# EAGLE design H0FR6 (EAGLE 9.6.1)

## Sheet 1 of 2
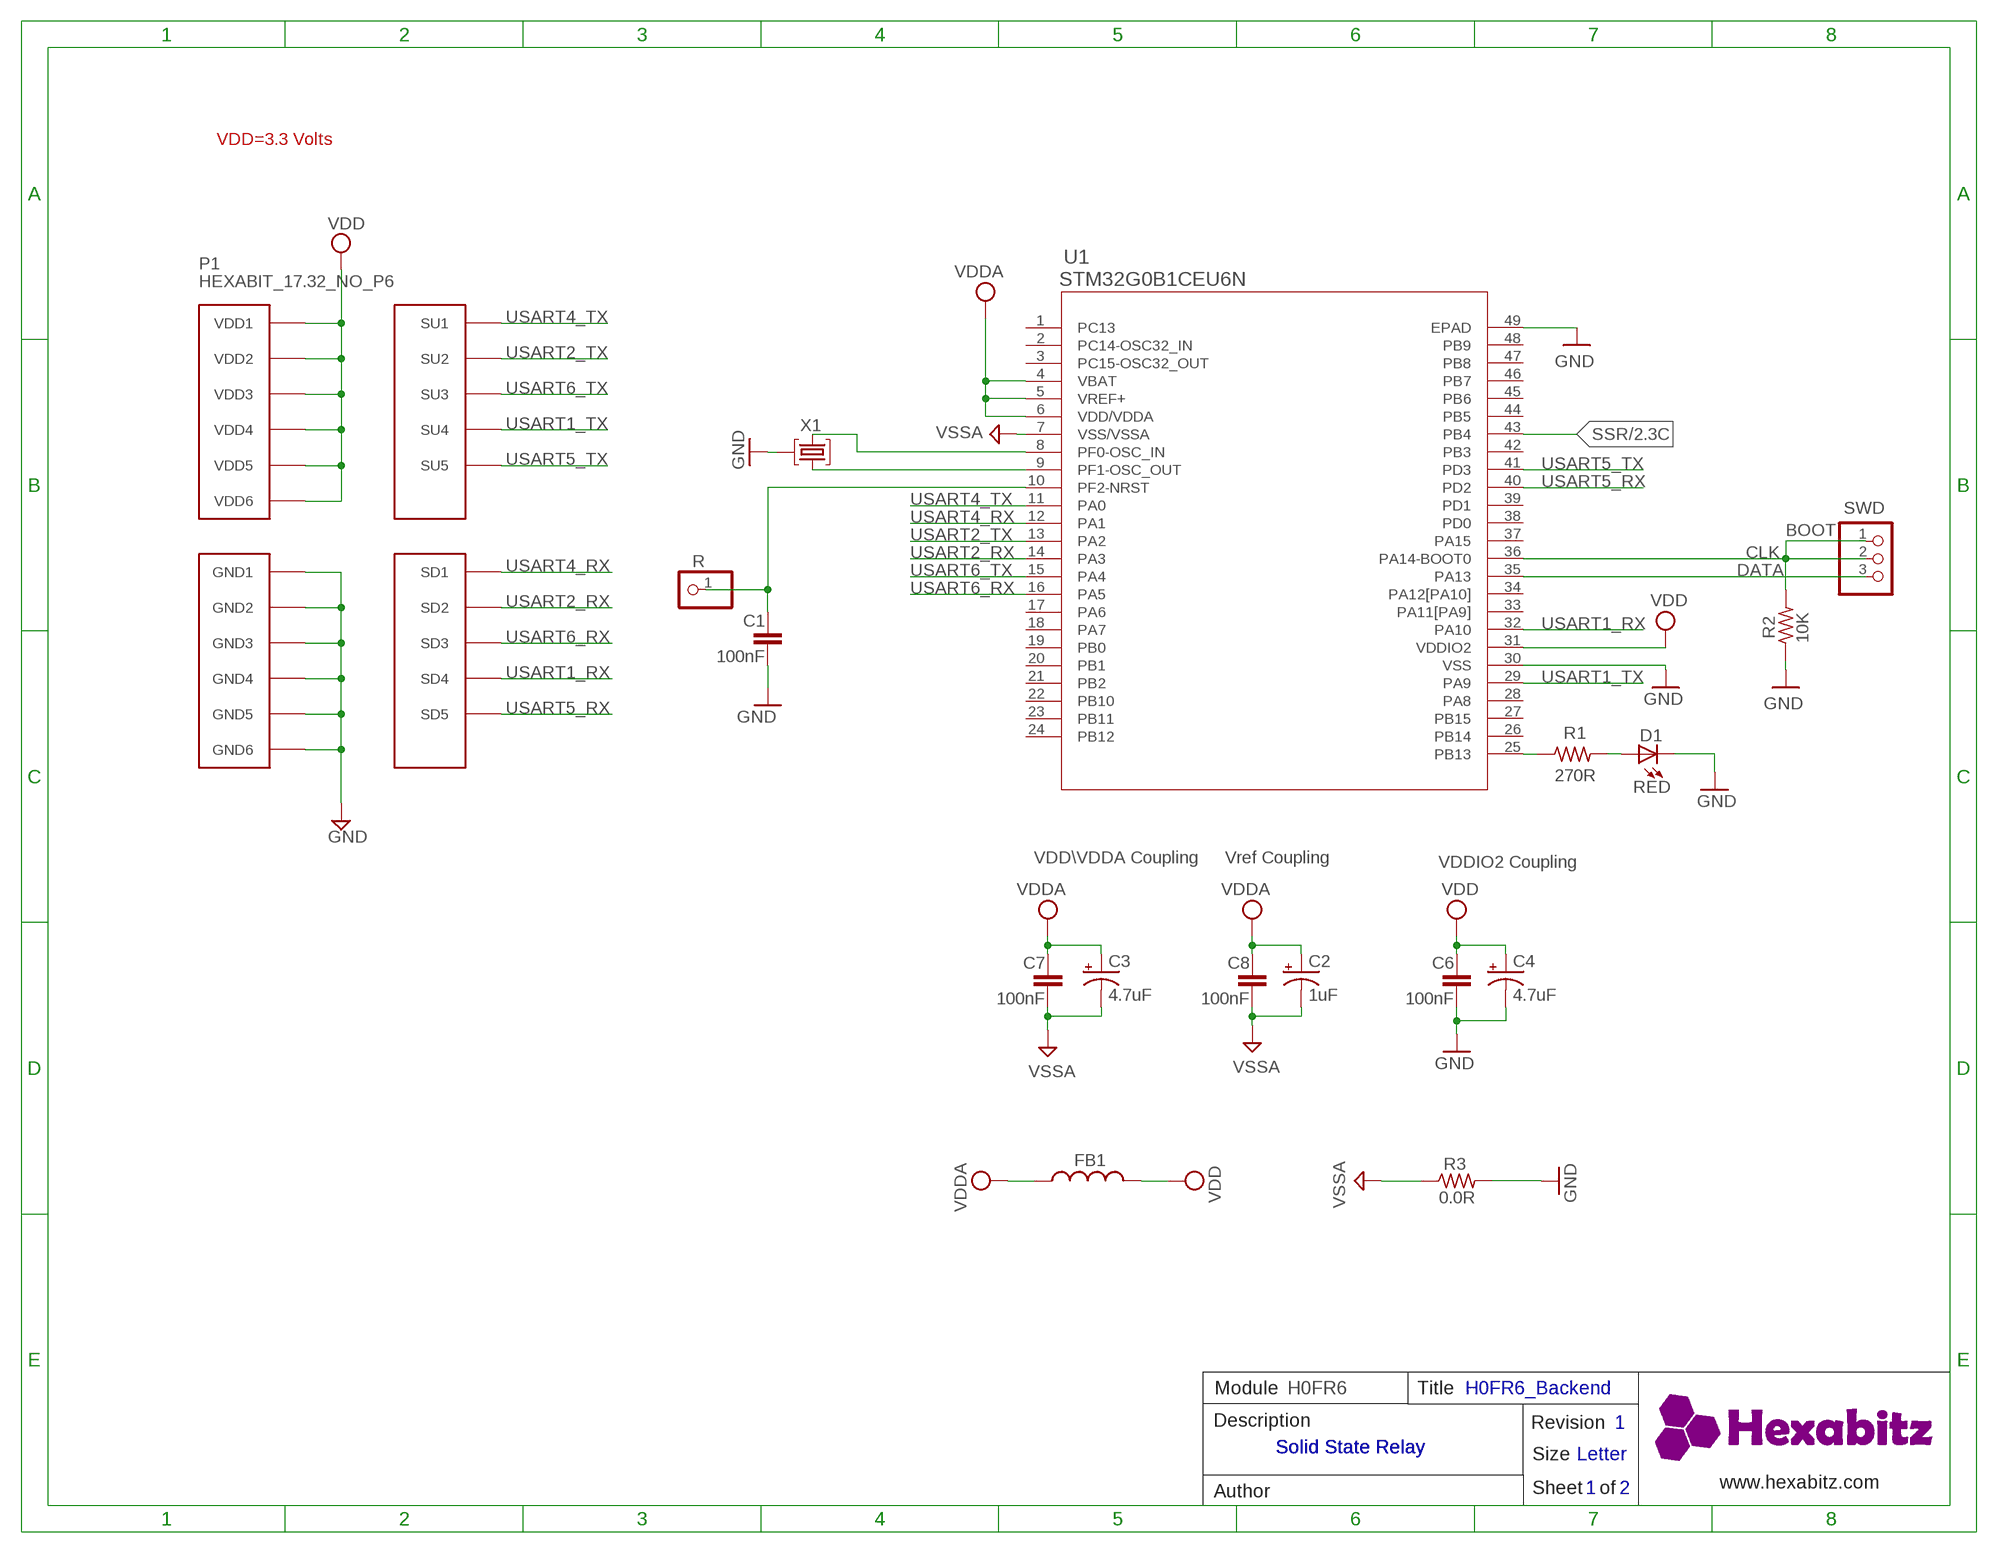
[diagram p0: schematic, sheet 1]

### Parts
C1  100nF  C-0603  [C-0603]
C2  1uF  C-0805-POL  [C-0805-POL]
C3  4.7uF  C-0805-POL  [C-0805-POL]
C4  4.7uF  C-0805-POL  [C-0805-POL]
C6  100nF  C-0603  [C-0603]
C7  100nF  C-0603  [C-0603]
C8  100nF  C-0603  [C-0603]
D1  RED  VLMS1300-GS08  [VLMS1300-GS08]
FB1  FB-0603  [FB-0603]
P1  HEXABIT_17.32_NO_P6  [HEXABIT_17.32_NO_P6]
R  R  PINHD-1X1  [1X01]
R1  270R  R-0603  [R-0603]
R2  10K  R-0603  [R-0603]
R3  0.0R  R-0603  [R-0603]
SWD  PINHD-1X3  [1X03]
U1  STM32G0B1CEU6N  [HEXABITZ_ICS_QFN_B1CEU6_STM-L]
X1  XTALL_CSTCE8M00G52  [XTALL_CSTCE8M00G52]

### Nets
CLK: R2.2 SWD.1 SWD.2 U1.36(PA14-BOOT0)
DATA: SWD.3 U1.35(PA13)
GND: C1.2 C4.2(-) C6.2 D1.C P1.PAD_PD7(GND1) P1.PAD_PD8(GND2) P1.PAD_PD9(GND3) P1.PAD_PD10(GND4) P1.PAD_PD11(GND5) P1.PAD_PD12(GND6) R2.1 R3.2 U1.30(VSS) U1.49(EPAD) X1.P$2 ; also sheet 2
N$1: D1.A R1.2
N$2: C1.1 R.1 U1.10(PF2-NRST)
N$3: R1.1 U1.25(PB13)
N$5: U1.9(PF1-OSC_OUT) X1.P$1
N$6: U1.8(PF0-OSC_IN) X1.P$3
SSR: U1.43(PB4) ; also sheet 2
USART1_RX: P1.PAD_PD4(SD4) U1.32(PA10)
USART1_TX: P1.PAD_PU4(SU4) U1.29(PA9)
USART2_RX: P1.PAD_PD2(SD2) U1.14(PA3)
USART2_TX: P1.PAD_PU2(SU2) U1.13(PA2)
USART4_RX: P1.PAD_PD1(SD1) U1.12(PA1)
USART4_TX: P1.PAD_PU1(SU1) U1.11(PA0)
USART5_RX: P1.PAD_PD5(SD5) U1.40(PD2)
USART5_TX: P1.PAD_PU5(SU5) U1.41(PD3)
USART6_RX: P1.PAD_PD3(SD3) U1.16(PA5)
USART6_TX: P1.PAD_PU3(SU3) U1.15(PA4)
VDD: C4.1(+) C6.1 FB1.2 P1.PAD_PU7(VDD1) P1.PAD_PU8(VDD2) P1.PAD_PU9(VDD3) P1.PAD_PU10(VDD4) P1.PAD_PU11(VDD5) P1.PAD_PU12(VDD6) U1.31(VDDIO2) ; also sheet 2
VDDA: C2.1(+) C3.1(+) C7.1 C8.1 FB1.1 U1.4(VBAT) U1.5(VREF+) U1.6(VDD/VDDA)
VSSA: C2.2(-) C3.2(-) C7.2 C8.2 R3.1 U1.7(VSS/VSSA)
Unconnected: U1.1(PC13) U1.2(PC14-OSC32_IN) U1.3(PC15-OSC32_OUT) U1.17(PA6) U1.18(PA7) U1.19(PB0) U1.20(PB1) U1.21(PB2) U1.22(PB10) U1.23(PB11) U1.24(PB12) U1.26(PB14) U1.27(PB15) U1.28(PA8) U1.33(PA11[PA9]) U1.34(PA12[PA10]) U1.37(PA15) U1.38(PD0) U1.39(PD1) U1.42(PB3) U1.44(PB5) U1.45(PB6) U1.46(PB7) U1.47(PB8) U1.48(PB9)

### Notes on the sheet
- VDD=3.3 Volts
- BOOT
- VDD\VDDA Coupling | Vref Coupling | VDDIO2 Coupling
- Module | H0FR6 | Title | H0FR6_Backend
- Description | Revision | 1
- Solid State Relay | Solid State Relay
- Size | Letter
- www.hexabitz.com
- Author | Sheet   of | 1 | 2
- C:/Users/Admin/Desktop/logodraft.bmp

## Sheet 2 of 2
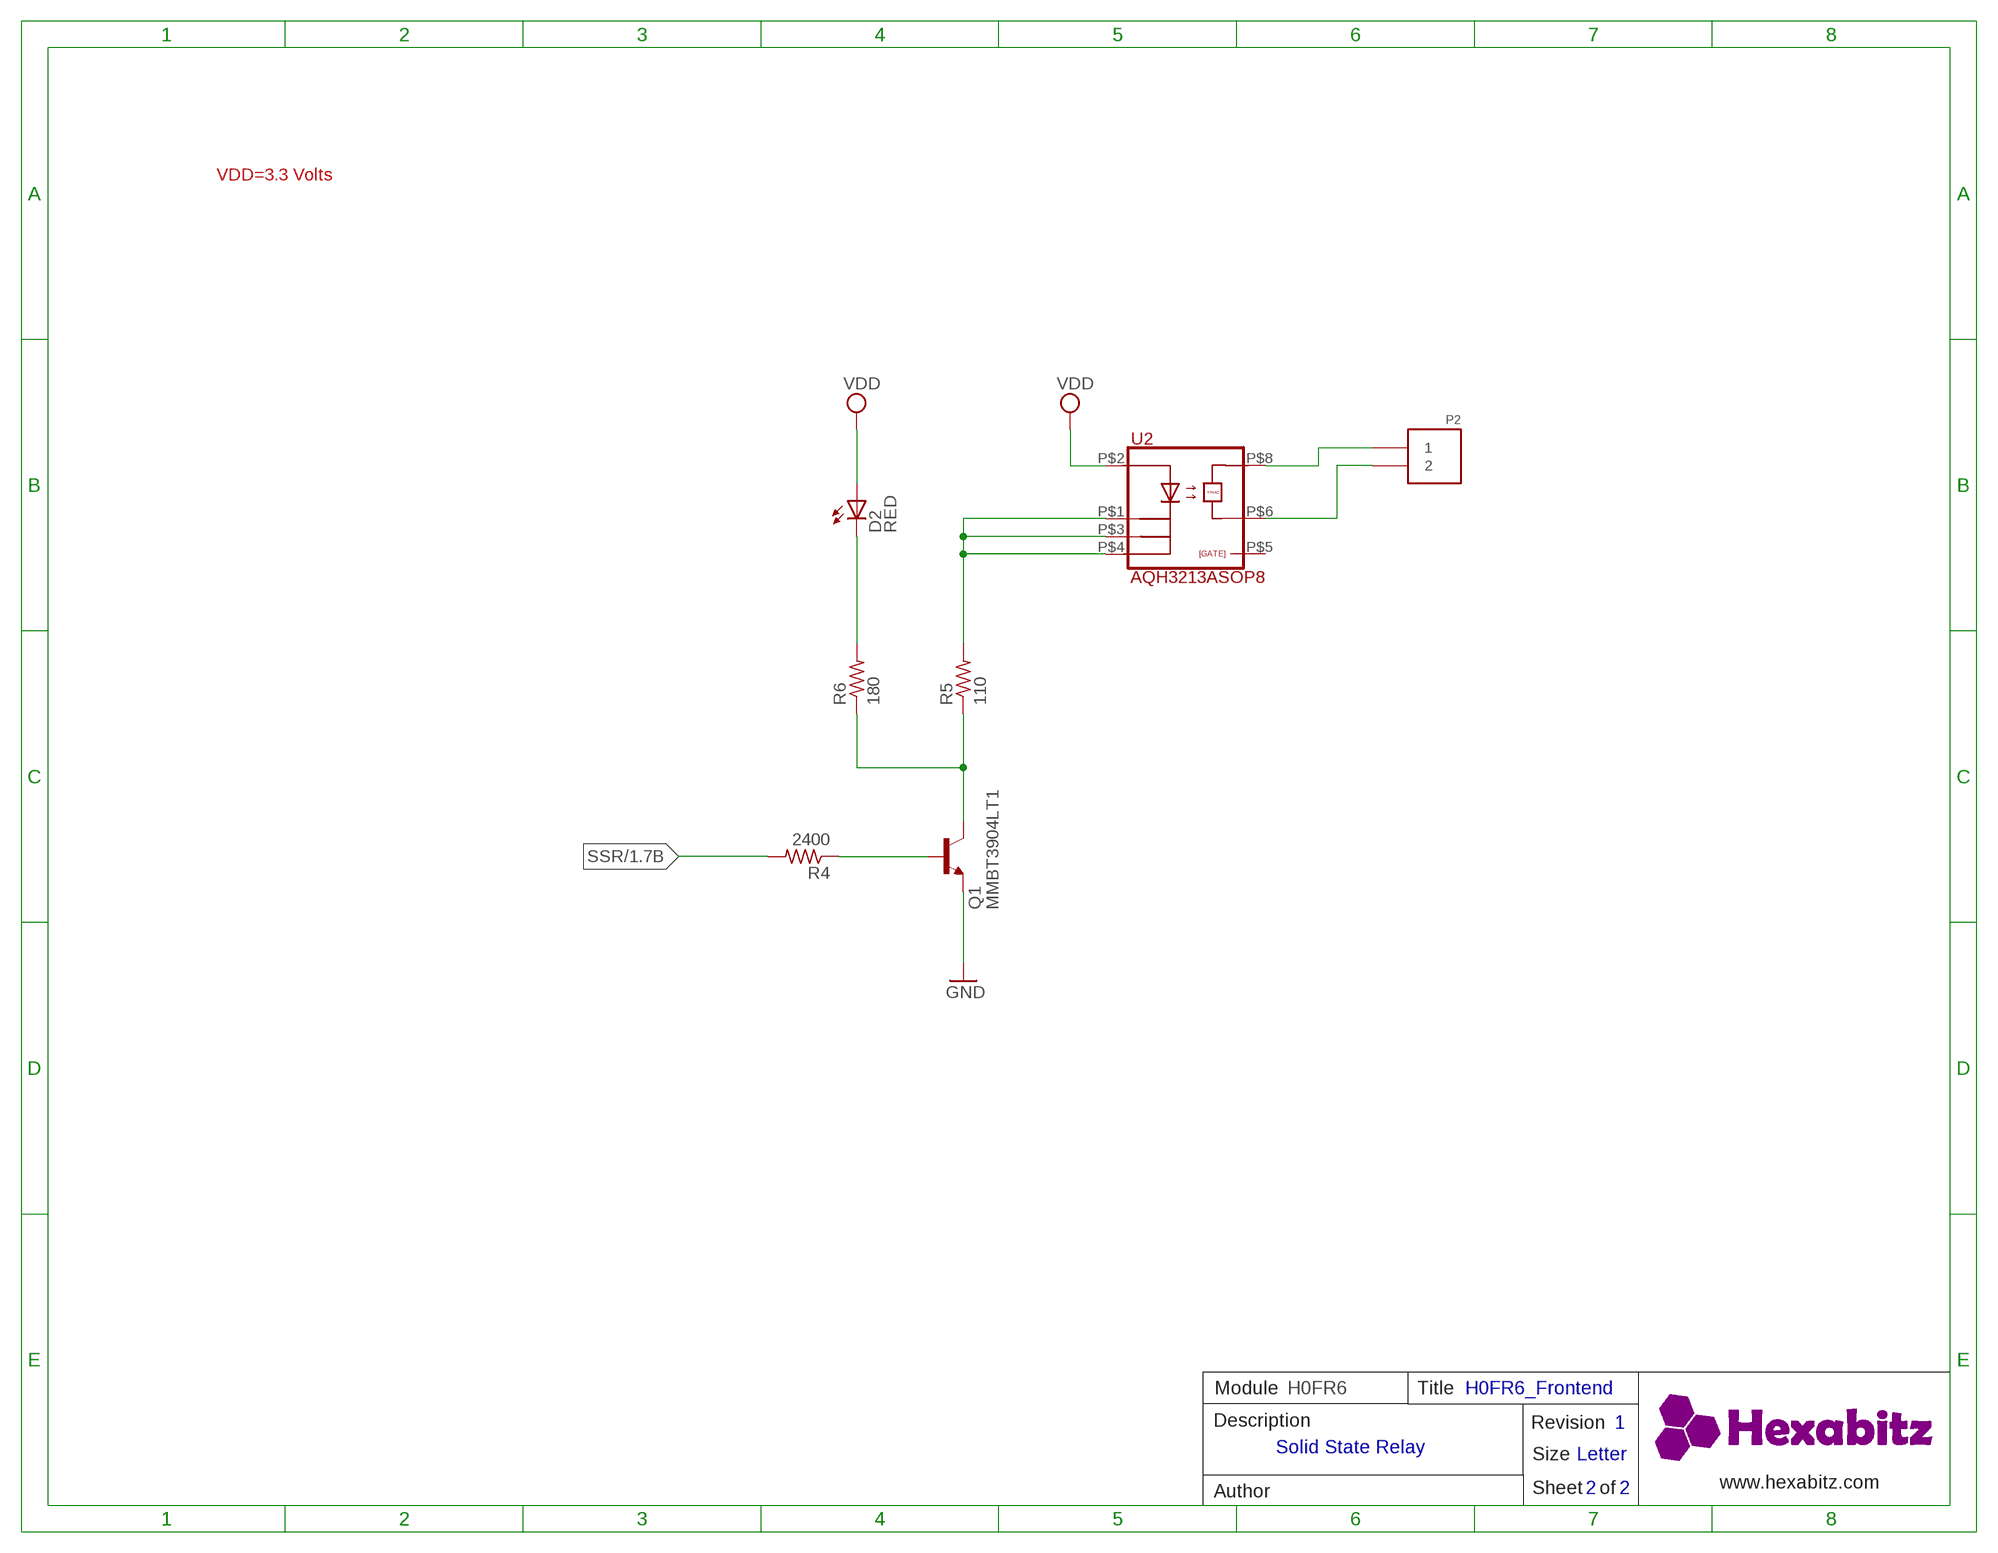
[diagram p1: schematic, sheet 2]

### Parts
D2  RED  VLMS1300-GS08  [VLMS1300-GS08]
P2  1546111-2  [1546111-2]
Q1  MMBT3904LT1  [MMBT3904LT1]
R4  2400  R-0603  [R-0603]
R5  110  R-0603  [R-0603]
R6  180  R-0603  [R-0603]
U2  AQH3213ASOP8  [AQH3213A]

### Nets
GND: Q1.2(E) ; also sheet 1
N$7: P2.1 U2.P$8
N$8: P2.2 U2.P$6
N$9: D2.C R6.2
N$10: R5.2 U2.P$1 U2.P$3 U2.P$4
N$11: Q1.3(C) R5.1 R6.1
N$13: Q1.1(B) R4.1
SSR: R4.2 ; also sheet 1
VDD: D2.A U2.P$2 ; also sheet 1
Unconnected: U2.P$5

### Notes on the sheet
- VDD=3.3 Volts
- Module | H0FR6 | Title | H0FR6_Frontend
- Description | Revision | 1
- Solid State Relay
- Size | Letter
- www.hexabitz.com
- Author | Sheet   of | 2 | 2

## Library data of the parts
C1 C6-C8 = HEXABITZ_RCLS:C-0603: CAP CER 10% X7R 0603
C2-C4 = HEXABITZ_RCLS:C-0805-POL: Cap Tant Solid SMD 2012
D1 = Hexabitz:VLMS1300-GS08: Red 0603 130° Clear 54 mcd 2 V Surface Mount ChipLED ; Octopart Url : http://octopart.com/vlms1300-gs08-vishay-21709201; MFN: Vishay; MPN: VLMS1300-GS08; OCTOPART_URL: https://octopart.com/vlms1300-gs08-vishay-21709201?r=sp&s=_gcP4_q8T1SC6PJQPTQ9yA
D2 = Hexabitz:VLMS1300-GS08: Red 0603 130° Clear 54 mcd 2 V Surface Mount ChipLED ; Octopart Url : http://octopart.com/vlms1300-gs08-vishay-21709201; MFN: Vishay; MPN: VLMY1300-GS08; OCTOPART_URL: https://octopart.com/vlmy1300-gs08-vishay-21709204
FB1 = HEXABITZ_RCLS:FB-0603: Ferrite Beads Multi-Layer 0603
P1 = hexabitz_connectors:HEXABIT_?_NO_P6: Hexabitz Hexagon Module Connector Hexagon side length = 17.32mm. The following ports are removed: P6
P2 = HEXABITZ_CONNECTION_PARTS:1546111-2: Conn Shrouded Header HDR 2 POS 5.08mm Solder ST Thru-Hole; MFN: TE Connectivity; MPN: 1546111-2; OCTOPART_URL: https://octopart.com/1546111-2-te+connectivity-40393355
Q1 = HEXABITZ_RCLS:MMBT3904LT1: TRANS NPN 40V 0.2A SOT23; MFN: ON Semiconductor; MOUNTING_STYLE: Surface Mount; MPN: MMBT3904LT1G; NUM_OF_PINS: 3; OCTOPART_ID: 0bb6c2bc2200d471; OCTOPART_URL: http://octopart.com/mmbt3904lt1g-on+semiconductor-3280; PACKAGE: SOT-23-3; PACKAGING: Reel; POLARITY: NPN; POWER_DISSIPATION: 0.225 W; PRODUCT_CATEGORY: Transistors Bipolar-BJT; SERIES: MMBT3904L; VOLTAGE_RATING_DC: 40.0 V
R = HEXABITZ_USER_INTERFACE_PARTS:PINHD-1X1: PIN HEADER; MFN: TE Connectivity; MPN: 87227-1; OCTOPART_URL: https://octopart.com/87227-1-te+connectivity-39512052?r=sp
R1-R3 = HEXABITZ_RCLS:R-0603: Thick Film Resistors - SMD 0603
R4 = HEXABITZ_RCLS:R-0603: Thick Film Resistors - SMD 0603; MFN: Yageo; MPN: RC0603JR-070RL; OCTOPART_URL: https://octopart.com/crcw06032k40jnea-vishay-40298967; RESISTANCE: 2400.0 Ω; TOLERANCE: ±5%
R5 = HEXABITZ_RCLS:R-0603: Thick Film Resistors - SMD 0603; MFN: Yageo; MPN: RC0402FR-07100RL; OCTOPART_URL: https://octopart.com/crcw0603110rfkea-vishay-39455532; RESISTANCE: 110.0 Ω; TOLERANCE: ±1%
R6 = HEXABITZ_RCLS:R-0603: Thick Film Resistors - SMD 0603; MFN: Yageo; MPN: RC0402FR-07100RL; OCTOPART_URL: https://octopart.com/erj-3geyj181v-panasonic-55403673; RESISTANCE: 180.0 Ω; TOLERANCE: ±5%
SWD = pinhead:PINHD-1X3: PIN HEADER
U1 = HEXABITZ_ICs:STM32G0B1CEU6N
U2 = Hexabitz:AQH3213A: AH-H Series SPST 1.2 A 600 V Surface Mount Zero Cross State Relay - SMD-8
X1 = Hexabitz:XTALL_CSTCE8M00G52: MURATA CSTCE8M00G52-R0 RESONATOR, SMD, 8MHZ ; Octopart Url : https://octopart.com/cstce8m00g52-r0-murata-7145559; MFN: Murata; MPN: CSTCE8M00G52Z-R0; OCTOPART_URL: https://octopart.com/cstce8m00g52z-r0-murata-17755941?r=sp&s=JDnNJnrHQhyS8Zk4ofFWXw

## Board
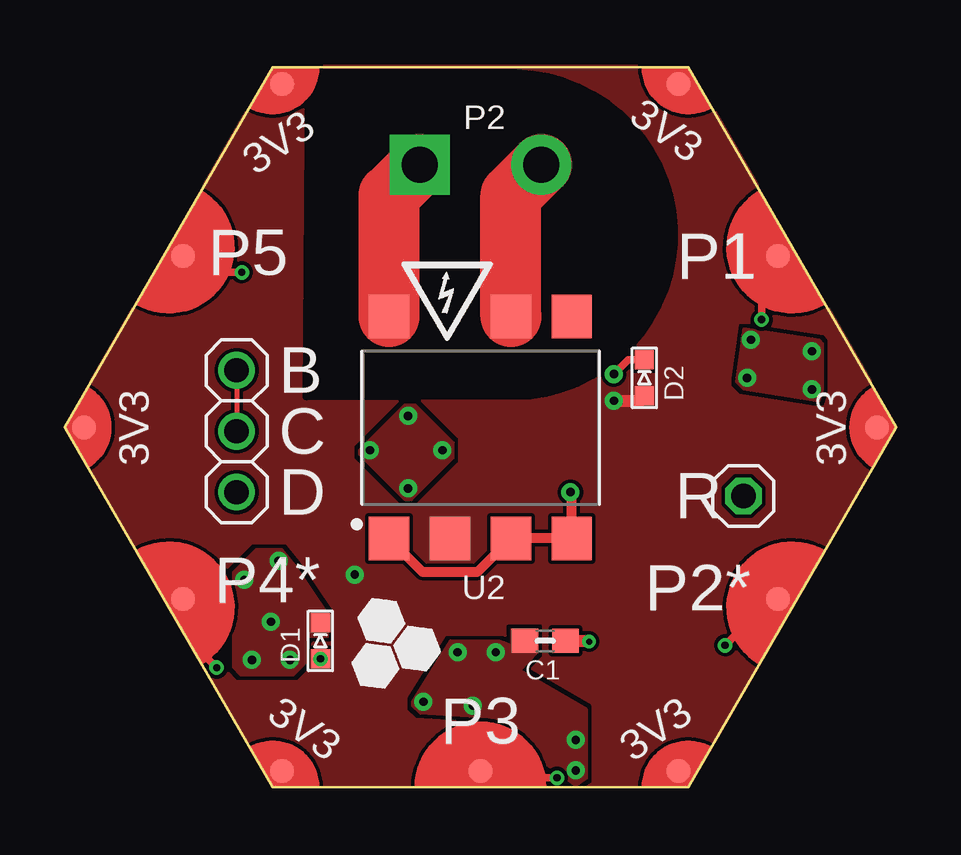
[diagram p2: board, top side]
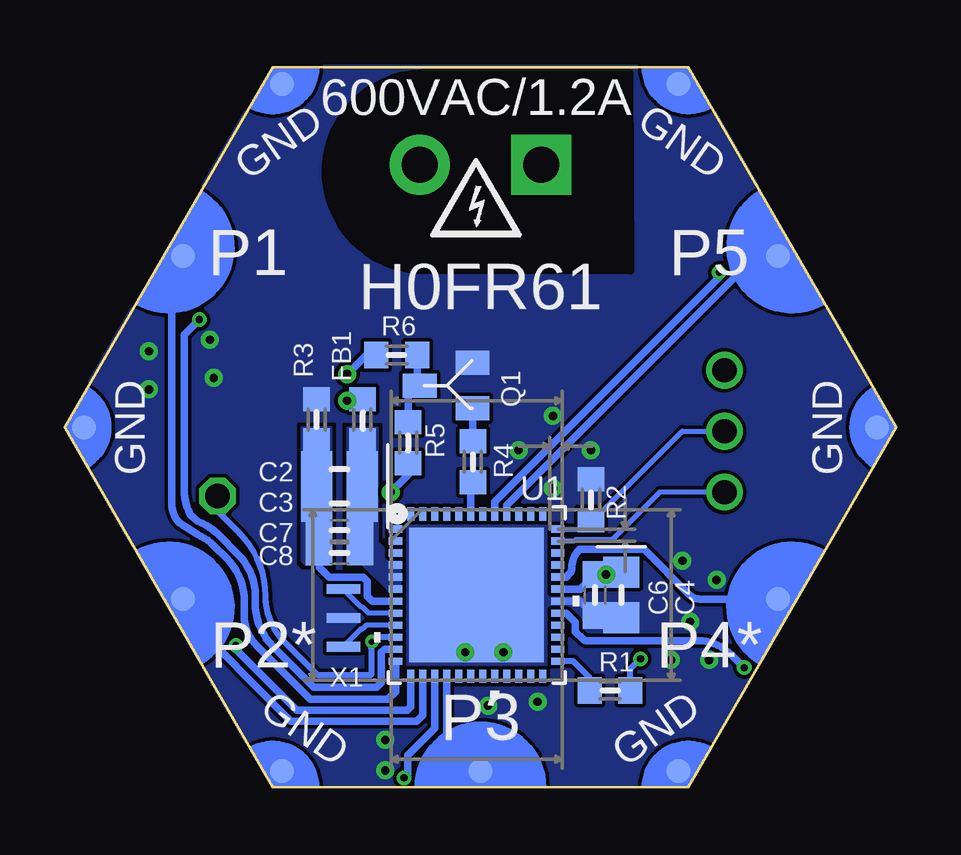
[diagram p3: board, bottom side, seen from below]

Size 34.64 x 30 mm. Coordinates in mm from the lower left corner, seen from the top.
Copper layers (1*16): Top 0.035mm / dielectric 1.5mm / Bottom 0.035mm
Design rules "2_layer *": minimum track width 7mil, minimum drill 0.2mm, track to track 6mil, track to pad 6mil, pad to pad 6mil, via to via 6mil, smd to smd 0mil, copper to edge 0mil, drill to drill 8mil, minimum pad ring 10mil, minimum via ring 6mil, stop-mask expansion 2mil, vias tented up to drill 15mil, thermal gap 10mil

### Footprints (pad centres in the part's own frame; a part is rotated, then mirrored left to right if it is on the bottom)
C-0603 = smd 1.1 x 1: 1 -0.85,0; 2 0.85,0
C-0805-POL = smd 1.3 x 1.5: 1 -0.95,0; 2 0.95,0
VLMS1300-GS08 = smd 0.8 x 0.8: A 0,0.75; C 0,-0.75
FB-0603 = smd 1 x 1.1: 1 -0.85,0; 2 0.85,0
HEXABIT_17.32_NO_P6 = smd 1 x 1 bottom: PAD_PD1 12.39,7.15; PAD_PD2 12.39,-7.15; PAD_PD3 0,-14.31; PAD_PD4 -12.39,-7.15; PAD_PD5 -12.39,7.15; PAD_PD7 8.26,14.31; PAD_PD8 16.52,0; PAD_PD9 8.26,-14.31; PAD_PD10 -8.26,-14.31; PAD_PD11 -16.52,0; PAD_PD12 -8.26,14.31 | smd 1 x 1: PAD_PU1 12.39,7.15; PAD_PU2 12.39,-7.15; PAD_PU3 0,-14.31; PAD_PU4 -12.39,-7.15; PAD_PU5 -12.39,7.15; PAD_PU7 8.26,14.31; PAD_PU8 16.52,0; PAD_PU9 8.26,-14.31; PAD_PU10 -8.26,-14.31; PAD_PU11 -16.52,0; PAD_PU12 -8.26,14.31
1546111-2 = drill 1.5 pad 2.5 square: 1 -2.54,0 | drill 1.5 pad 2.5: 2 2.54,0
MMBT3904LT1 = smd 1 x 1.4: 1 -0.95,-1.1; 2 0.95,-1.1; 3 0,1.1
1X01 = drill 1.016 octagon: 1 0,0
R-0603 = smd 1 x 1.1: 1 -0.85,0; 2 0.85,0
1X03 = drill 1.016: 1 -2.54,0; 2 0,0; 3 2.54,0
HEXABITZ_ICS_QFN_B1CEU6_STM-L = smd 0.55 x 0.297: 1 -3.38,2.751; 2 -3.38,2.251; 3 -3.38,1.75; 4 -3.38,1.25; 5 -3.38,0.75; 6 -3.38,0.25; 7 -3.38,-0.25; 8 -3.38,-0.75; 9 -3.38,-1.25; 10 -3.38,-1.75; 11 -3.38,-2.251; 12 -3.38,-2.751; 25 3.38,-2.751; 26 3.38,-2.251; 27 3.38,-1.75; 28 3.38,-1.25; 29 3.38,-0.75; 30 3.38,-0.25; 31 3.38,0.25; 32 3.38,0.75; 33 3.38,1.25; 34 3.38,1.75; 35 3.38,2.251; 36 3.38,2.751 | smd 0.297 x 0.55: 13 -2.751,-3.38; 14 -2.251,-3.38; 15 -1.75,-3.38; 16 -1.25,-3.38; 17 -0.75,-3.38; 18 -0.25,-3.38; 19 0.25,-3.38; 20 0.75,-3.38; 21 1.25,-3.38; 22 1.75,-3.38; 23 2.251,-3.38; 24 2.751,-3.38; 37 2.751,3.38; 38 2.251,3.38; 39 1.75,3.38; 40 1.25,3.38; 41 0.75,3.38; 42 0.25,3.38; 43 -0.25,3.38; 44 -0.75,3.38; 45 -1.25,3.38; 46 -1.75,3.38; 47 -2.251,3.38; 48 -2.751,3.38 | smd 5.6 x 5.6: 49 0,0
AQH3213A = smd 1.812 x 1.672: P$1 -4.62,3.81; P$2 -4.62,1.27; P$3 -4.62,-1.27; P$4 -4.62,-3.81; P$5 4.62,-3.81; P$6 4.62,-1.27; P$8 4.62,3.81
XTALL_CSTCE8M00G52 = smd 1.4 x 0.4: P$1 0,1.2; P$2 0,0; P$3 0,-1.2

### Placement (x,y rotation side)
C1  20.02,6.11 180 top
C2  23.19,13.25 180 bottom
C3  23.19,11.83 180 bottom
C4  11.45,8.02 270 bottom
C6  12.56,8.02 270 bottom
C7  23.19,10.71 180 bottom
C8  23.19,9.76 180 bottom
D1  10.65,6.11 180 top
D2  24.15,17.06 180 top
FB1  22.24,15.32 90 bottom
P1  17.32,15 0 top
P2  17.32,25.95 0 top
Q1  18.75,16.75 90 bottom
R  28.27,12.14 0 top
R1  11.92,4.05 0 bottom
R2  12.72,11.98 270 bottom
R3  24.15,15.32 90 bottom
R4  17.64,13.57 270 bottom
R5  20.34,14.37 270 bottom
R6  20.81,18.02 180 bottom
SWD  7.16,14.84 270 top
U1  17.48,8.02 0 bottom
U2  17.32,15 90 top
X1  23.04,7.06 180 bottom

### Tracks (layer width: path | path; a pad name or v marks a point on that pad's centre or on a via)
CLK
  Top 0.203: SWD.1 SWD.2
  Bottom 0.203: U1.36 13.08,10.77 R2.2 12.61,11.13 8.91,14.84 SWD.2
DATA
  Bottom 0.203: U1.35 13.42,10.27 13.36,10.33 11.83,10.33 9.86,12.3 SWD.3
GND  (via drill 0.35 pad 0.75)
  Bottom 0.305: U1.30 13.16,7.76 C6.2 11.55,7.17
  other vias: 7.48,8.65 8.91,9.44 7.79,5.32 9.38,5.32 14.94,3.57 16.37,5.63 17.96,5.63 17,3.41 21.29,0.71 21.29,1.98 8.59,6.9 31.13,18.18 31.13,16.59 28.59,18.65 28.43,17.06 14.3,15.48 15.73,14.05 14.3,12.46 12.72,14.05
  pour Bottom (rank 2, no thermals): 8.67,0.05 25.99,0.05 34.65,15.05 25.99,30.05 8.67,30.05 0.01,15.05
  pour Top (no thermals): 7,8.97 7,5 7.32,4.68 9.54,4.68 10.02,5.16 10.02,6.11 10.18,6.27 10.97,6.27 10.97,7.22 9.61,9.25 9.07,9.92 9.06,9.92 7.95,9.92
  pour Top (no thermals): 14.46,3.41 14.78,3.09 17.16,2.94 19.7,5.63 19.7,6.59 18.59,6.59 18.59,5.95 18.11,6.11 16.05,6.11 14.46,3.57
  pour Top (no thermals): 21.77,0.4 21.77,3.25 18.75,5 16.95,3.2 21.29,0.08
  pour Top (no thermals): 28.27,19.13 27.96,16.91 28.27,16.59 31.29,16.11 31.45,16.11 31.61,16.59 31.61,18.49 31.45,18.65
  pour Top (no thermals): 14.14,15.95 12.24,14.05 12.24,13.89 14.14,11.98 14.3,11.98 14.46,11.98 16.21,13.73 16.21,14.37 14.62,15.95
KEEPOUT
  cutout Top: 10.16,29.77 18.8,29.77 arc-172 19.39,16.32 10.07,16.28
  cutout Bottom: 11.11,29.77 19.75,29.77 arc-172 20.12,21.56 11.05,21.52
N$1  (via drill 0.3 pad 0.6)
  Bottom 0.254: R1.2 11.07,4.94 D1.A
  other vias: 10.65,5.36
N$2  (via drill 0.25)
  Top 0.508: C1.1 21.81,6.11 v21.85,6.08
  Bottom 0.254: U1.10 21.66,6.26 v21.85,6.08 21.85,5.85 21.88,5.81 21.88,4.68 24.1,4.68 25.48,6.06 arc45 26.27,7.98 arc-45 27.35,10.59 28.27,11.51 R.1
N$3
  Bottom 0.254: R1.1 12.77,4.58 13.46,5.26 U1.25
N$5
  Bottom 0.203: X1.P$1 22.29,6.61 22.23,6.61 22.07,6.76 U1.9
N$6
  Bottom 0.203: X1.P$3 22.29,7.52 22.23,7.52 21.98,7.26 U1.8
N$7
  Top 2.54: U2.P$8 13.51,24.68 P2.1
N$8
  Top 2.54: U2.P$6 18.59,24.68 P2.2
N$9  (via drill 0.35 pad 0.75)
  Top 0.305: D2.C 23.47,17.81 v22.88,17.22
  Bottom 0.305: v22.88,17.22 22.08,18.02 R6.2
N$10  (via drill 0.35 pad 0.75)
  Top 0.406: U2.P$1 14.92,8.97 17.18,8.97 U2.P$3 U2.P$4 21.13,12.24 v21.07,12.3
  Bottom 0.305: v21.07,12.3 20.34,13.03 R5.2
N$11
  Bottom 0.305: R5.1 20.34,16.26 Q1.3 19.96,16.86 R6.1
N$13
  Bottom 0.305: R4.1 17.64,15.78 Q1.1
SSR
  Bottom 0.305: U1.43 17.73,12.63 R4.2
USART1_RX
  Bottom 0.305: U1.32 13.74,8.77 13.62,8.89 arc-45 13.52,9.13 13.52,9.13 arc45 13.19,9.92 10.49,9.92 | 10.49,9.92 | 10.49,9.92 8.59,8.02 arc-45 8.19,7.85 P1.PAD_PD4
USART1_TX  (via drill 0.3 pad 0.55)
  Top 0.305: v6.33,4.99 5.58,5.74 4.93,6.87 P1.PAD_PU4
  Bottom 0.305: U1.29 13.74,7.26 13.36,6.88 13.36,6.49 13.06,6.19 arc-45 12.88,6.11 8.24,6.11 arc45 6.89,5.55 v6.33,4.99
USART2_RX
  Bottom 0.305: U1.14 19.73,3.01 19.98,2.76 25.21,2.76 29.71,7.26 P1.PAD_PD2
USART2_TX  (via drill 0.3 pad 0.55)
  Top 0.305: v27.51,5.92 29.44,7.85 P1.PAD_PU2
  Bottom 0.305: U1.13 20.23,3.37 20.38,3.22 24.97,3.22 27.51,5.76 v27.51,5.92
USART4_RX
  Bottom 0.305: U1.12 20.86,3.99 21.18,3.68 24.41,3.68 26.64,5.91 arc45 27.16,7.16 27.16,7.77 arc-45 27.89,9.54 28.43,10.07 arc-22 29.13,10.54 29.86,11.03 arc45 30.19,11.81 30.19,21.67 P1.PAD_PD1
USART4_TX  (via drill 0.3 pad 0.55)
  Top 0.305: v29.03,19.49 29.03,21.47 P1.PAD_PU1
  Bottom 0.305: v29.03,19.49 29.67,18.86 29.67,12.45 arc-23 29.48,11.52 arc-34 29.19,11.17 29.09,11.1 arc22 28.23,10.53 27.41,9.7 arc45 26.7,8 26.7,7.69 arc-45 25.95,5.86 24.27,4.18 21.63,4.18 21.45,4.36 21.45,5.63 21.32,5.76 U1.11
USART5_RX
  Bottom 0.305: U1.40 16.23,11.75 5.83,22.15 P1.PAD_PD5
USART5_TX  (via drill 0.3 pad 0.55)
  Top 0.305: v7.37,21.46 5.62,21.46 P1.PAD_PU5
  Bottom 0.305: U1.41 16.73,11.9 7.37,21.25 v7.37,21.46
USART6_RX
  Bottom 0.305: U1.16 18.73,4.48 18.72,4.46 18.72,0.69 P1.PAD_PD3
USART6_TX  (via drill 0.3 pad 0.55)
  Top 0.305: v20.51,0.4 17.61,0.4 P1.PAD_PU3
  Bottom 0.305: U1.15 19.23,2.47 20.35,1.35 20.35,0.56 v20.51,0.4
VDD  (via drill 0.35 pad 0.75)
  Top 0.508: v22.88,16.11 23.94,16.11 D2.A
  Bottom 0.305: U1.31 13.16,8.27 C6.1 v12.08,8.86
  Bottom 0.508: FB1.2 22.82,16.17 v22.88,16.11 | C4.1 11.98,8.96 v12.08,8.86
  pour Top (rank 2, no thermals): 8.67,0.05 25.99,0.05 34.65,15.05 25.99,30.05 8.67,30.05 0.01,15.05
VDDA
  pour Bottom (no thermals): 20.65,9.44 20.65,8.17 21.13,8.17 22.24,9.29 22.88,9.29 22.88,15 21.61,15 21.61,10.24 20.81,9.44
VSSA
  Bottom 0.305: U1.7 21.83,7.76 22.03,7.96 22.03,8.59 22.21,8.77 23.63,8.77 24.04,9.18 C8.2
  pour Bottom (no thermals): 23.51,15 24.78,15 24.78,9.44 24.62,9.29 23.51,9.29

### Text on the board
tPlace: 3V3 | 3V3 | P5 | P1 | 3V3 | 3V3 | P4* | P2* | P3 | 3V3 | 3V3
bPlace: 600VAC/1.2A | GND | GND | P5 | P1 | H0FR61 | GND | GND | P4* | P2* | P3 | GND | GND
tNames: B | C | D | R